# EAGLE design Buck-Boost-Switch-Mode-Power-Supply-Module (EAGLE 9.6.2)
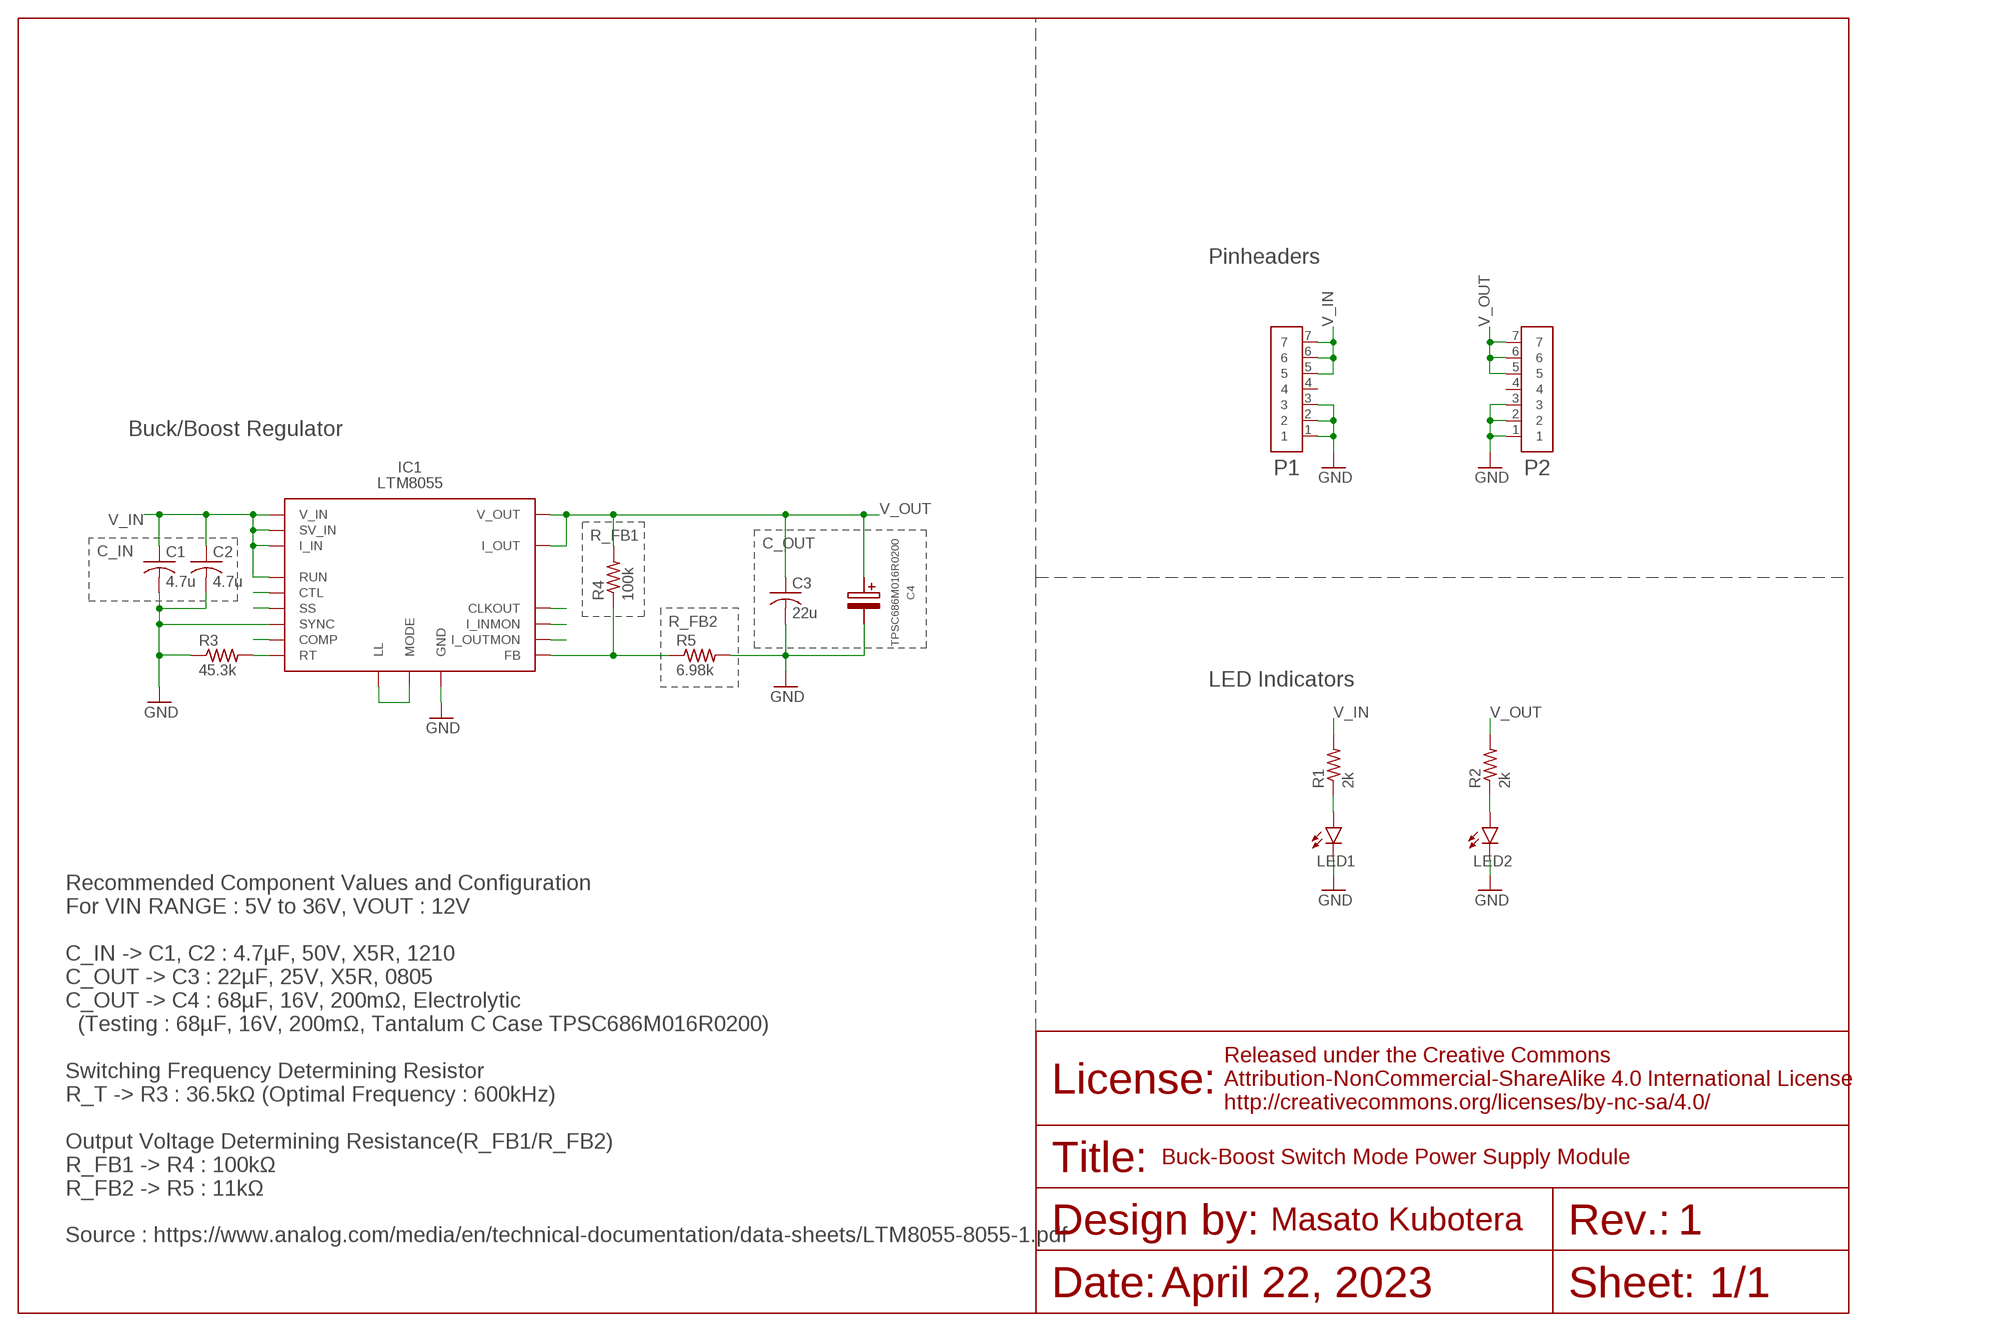
[diagram p0: schematic, sheet 1]

## Parts
C1  4.7u  C-USC0805  [C0805]
C2  4.7u  C-USC0805  [C0805]
C3  22u  C-USC0805  [C0805]
C4  TPSC686M016R0200  [TPSC686M016R0200]
IC1  LTM8055  [LTM8055]
LED1  LEDSML0603  [SML0603]
LED2  LEDSML0603  [SML0603]
P1  PINHEADER-7P  [7P]
P2  PINHEADER-7P  [7P]
R1  2k  R-US_R0603  [R0603]
R2  2k  R-US_R0603  [R0603]
R3  45.3k  R-US_R0603  [R0603]
R4  100k  R-US_R0603  [R0603]
R5  6.98k  R-US_R0603  [R0603]

## Nets
CLKOUT: IC1.G1(CLKOUT)
COMP: IC1.J2(COMP)
FB: IC1.J1(FB) R4.1 R5.1
GND: C1.2 C2.2 C3.2 C4.- IC1.A7(GND) IC1.A8(GND) IC1.A9(GND) IC1.A10(GND) IC1.A11(GND) IC1.B7(GND) IC1.B8(GND) IC1.B9(GND) IC1.B10(GND) IC1.B11(GND) IC1.C7(GND) IC1.C8(GND) IC1.C9(GND) IC1.C10(GND) IC1.C11(GND) IC1.D2(GND) IC1.D3(GND) IC1.D4(GND) IC1.D5(GND) IC1.D6(GND) IC1.D7(GND) IC1.D8(GND) IC1.D9(GND) IC1.D10(GND) IC1.D11(GND) IC1.E1(GND) IC1.E2(GND) IC1.E3(GND) IC1.E4(GND) IC1.E5(GND) IC1.E6(GND) IC1.E7(GND) IC1.E8(GND) IC1.E9(GND) IC1.E10(GND) IC1.E11(GND) IC1.F2(GND) IC1.F3(GND) IC1.F4(GND) IC1.F5(GND) IC1.F6(GND) IC1.F7(GND) IC1.F8(GND) IC1.F9(GND) IC1.G3(GND) IC1.G4(GND) IC1.G5(GND) IC1.G6(GND) IC1.G7(GND) IC1.G8(GND) IC1.G9(GND) IC1.H2(SYNC) IC1.H3(GND) IC1.H4(GND) IC1.H5(GND) IC1.H6(GND) IC1.H7(GND) IC1.H8(GND) IC1.H9(GND) IC1.J3(GND) IC1.J4(GND) IC1.J5(GND) IC1.J6(GND) IC1.J7(GND) IC1.J8(GND) IC1.J9(GND) IC1.K3(GND) IC1.K4(GND) IC1.K5(GND) IC1.K6(GND) IC1.K7(GND) IC1.K8(GND) IC1.K9(GND) IC1.L1(GND) IC1.L5(GND) IC1.L6(GND) IC1.L7(GND) IC1.L8(GND) LED1.C LED2.C P1.1 P1.2 P1.3 P2.1 P2.2 P2.3 R3.1 R5.2
I_INMON: IC1.L3(I_INMON)
I_OUTMON: IC1.L2(I_OUTMON)
LED1: LED1.A R1.1
LED2: LED2.A R2.1
MODE: IC1.F1(LL) IC1.G2(MODE)
RT: IC1.H1(RT) R3.2
SS: IC1.K1(SS)
STL: IC1.K2(CTL)
V_IN: C1.1 C2.1 IC1.F10(SV_IN) IC1.F11(SV_IN) IC1.G10(V_IN) IC1.G11(V_IN) IC1.H10(V_IN) IC1.H11(V_IN) IC1.J10(V_IN) IC1.J11(V_IN) IC1.K10(V_IN) IC1.K11(V_IN) IC1.L4(RUN) IC1.L9(I_IN) IC1.L10(V_IN) IC1.L11(V_IN) P1.5 P1.6 P1.7 R1.2
V_OUT: C3.1 C4.+ IC1.A1(V_OUT) IC1.A2(V_OUT) IC1.A3(V_OUT) IC1.A4(V_OUT) IC1.A5(V_OUT) IC1.A6(V_OUT) IC1.B1(V_OUT) IC1.B2(V_OUT) IC1.B3(V_OUT) IC1.B4(V_OUT) IC1.B5(V_OUT) IC1.B6(V_OUT) IC1.C1(V_OUT) IC1.C2(V_OUT) IC1.C3(V_OUT) IC1.C4(V_OUT) IC1.C5(V_OUT) IC1.C6(V_OUT) IC1.D1(I_OUT) P2.5 P2.6 P2.7 R2.2 R4.2
Unconnected: P1.4 P2.4

## Notes on the sheet
- Pinheaders
- Buck/Boost Regulator
- R_FB1
- C_OUT
- C_IN
- R_FB2
- LED Indicators
- Recommended Component Values and Configuration
  For VIN RANGE : 5V to 36V, VOUT : 12V
  
  C_IN -> C1, C2 : 4.7µF, 50V, X5R, 1210
  C_OUT -> C3 : 22µF, 25V, X5R, 0805
  C_OUT -> C4 : 68µF, 16V, 200mΩ, Electrolytic
    (Testing : 68µF, 16V, 200mΩ, Tantalum C Case TPSC686M016R0200)
  
  Switching Frequency Determining Resistor
  R_T -> R3 : 36.5kΩ (Optimal Frequency : 600kHz)
  
  Output Voltage Determining Resistance(R_FB1/R_FB2) 
  R_FB1 -> R4 : 100kΩ
  R_FB2 -> R5 : 11kΩ
  
  Source : https://www.analog.com/media/en/technical-documentation/data-sheets/LTM8055-8055-1.pdf
- Buck-Boost Switch Mode Power Supply Module
- 1
- April 22, 2023 | 1/1

## Library data of the parts
C1-C3 = rcl:C-US: CAPACITOR, American symbol; SPICEPREFIX: C
C4 = TPSC686M016R0200:TPSC686M016R0200
IC1 = LTM8055:LTM8055
LED1 LED2 = led:LED: LED OSRAM: - CHIPLED LG R971, LG N971, LY N971, LG Q971, LY Q971, LO R971, LY R971 LH N974, LH R974 LS Q976, LO Q976, LY Q976 LO Q996 - Hyper CHIPLED LW Q18S LB Q993, LB Q99A, LB R99A - SideLED LS A670, LO A670, LY A670, LG A670, LP A670 LB A673, LV A673, LT A673, LW A673 LH A674 LY A675 LS A676, LA A676, LO A676, LY A676, LW A676 LS A679, LY A679, LG A679 - Hyper Micro SIDELED® LS Y876, LA Y876, LO Y876, LY Y876 LT Y87S - SmartLED LW L88C, LW L88S LB L89C, LB L89S, LG L890 LS L89K, LO L89K, LY L89K LS L896, LA L896, LO L896, LY L896 - TOPLED LS T670, LO T670, LY T670, LG T670, LP T670 LSG T670, LSP T670, LSY T670, LOP T670, LYG T670 LG T671, LOG T671, LSG T671 LB T673, LV T673, LT T673, LW T673 LH T674 LS T676, LA T676, LO T676, LY T676, LB T676, LH T676, LSB T676, LW T676 LB T67C, LV T67C, LT T67C, LS T67K, LO T67K, LY T67K, LW E67C LS E67B, LA E67B, LO E67B, LY E67B, LB E67C, LV E67C, LT E67C LW T67C LS T679, LY T679, LG T679 LS T770, LO T770, LY T770, LG T770, LP T770 LB T773, LV T773, LT T773, LW T773 LH T774 LS E675, LA E675, LY E675, LS T675 LS T776, LA T776, LO T776, LY T776, LB T776 LHGB T686 LT T68C, LB T68C - Hyper Mini TOPLED® LB M676 - Mini TOPLED Santana® LG M470 LS M47K, LO M47K, LY M47K Source: http://www.osram.convergy.de LUXEON: - LUMILED® LXK2-PW12-R00, LXK2-PW12-S00, LXK2-PW14-U00, LXK2-PW14-V00 LXK2-PM12-R00, LXK2-PM12-S00, LXK2-PM14-U00 LXK2-PE12-Q00, LXK2-PE12-R00, LXK2-PE12-S00, LXK2-PE14-T00, LXK2-PE14-U00 LXK2-PB12-K00, LXK2-PB12-L00, LXK2-PB12-M00, LXK2-PB14-N00, LXK2-PB14-P00, LXK2-PB14-Q00 LXK2-PR12-L00, LXK2-PR12-M00, LXK2-PR14-Q00, LXK2-PR14-R00 LXK2-PD12-Q00, LXK2-PD12-R00, LXK2-PD12-S00 LXK2-PH12-R00, LXK2-PH12-S00 LXK2-PL12-P00, LXK2-PL12-Q00, LXK2-PL12-R00 Source: www.luxeon.com KINGBRIGHT: KA-3528ASYC Source: www.kingbright.com
P1 P2 = Pinheader:PINHEADER-7P
R1-R5 = rcl:R-US_: RESISTOR, American symbol; SPICEPREFIX: R

## Net classes
0 default: width 0.203 mm, drill 0.35 mm, clearance 0.203 mm

## Board
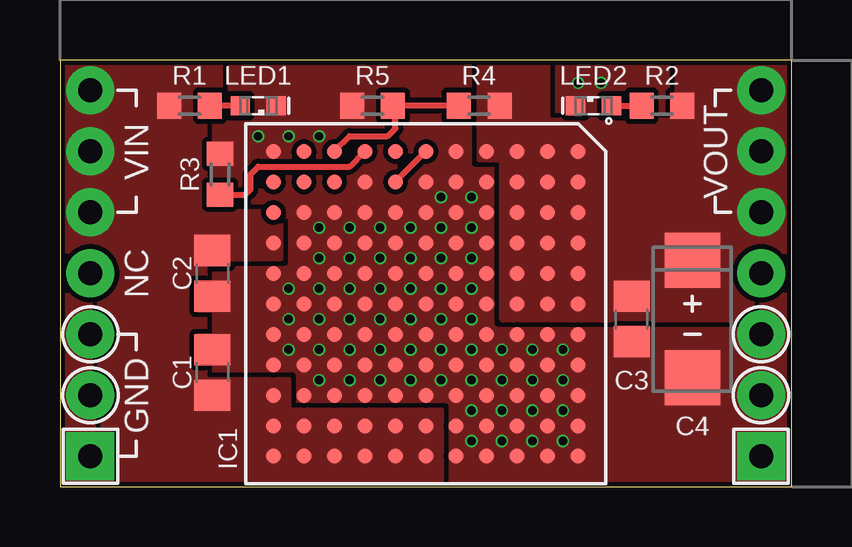
[diagram p1: board, top side]
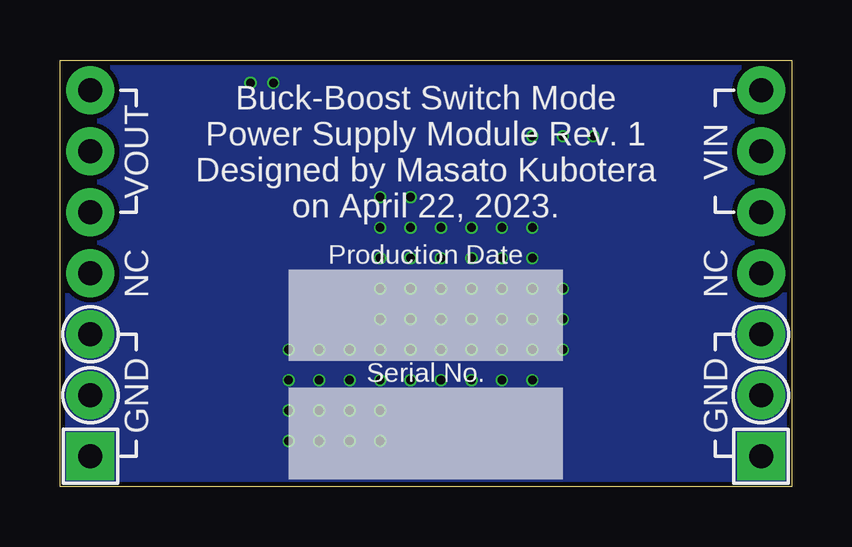
[diagram p2: board, bottom side, seen from below]

Size 30.48 x 17.78 mm. Coordinates in mm from the lower left corner, seen from the top.
Outline: 0,0 30.48,0 30.48,17.78 0,17.78 0,0
Copper layers (1*16): Top 0.035mm / dielectric 1.6mm / Bottom 0.035mm
Design rules "jlcpcb-2layers": minimum track width 5mil, minimum drill 0.3mm, track to track 5mil, track to pad 5mil, pad to pad 5mil, via to via 5mil, smd to smd 5mil, copper to edge 0.2mm, drill to drill 6mil, minimum pad ring 10mil, minimum via ring 3mil, stop-mask expansion 4mil, vias tented up to drill 0mil, thermal gap 10mil

### Footprints (pad centres in the part's own frame; a part is rotated, then mirrored left to right if it is on the bottom)
C0805 = smd 1.3 x 1.5: 1 -0.95,0; 2 0.95,0
TPSC686M016R0200 = smd 2.3 x 2.3: + -2.45,0; - 2.45,0
LTM8055 = smd 0.635 x 0.635: A1 -6.35,6.35; A2 -5.08,6.35; A3 -3.81,6.35; A4 -2.54,6.35; A5 -1.27,6.35; A6 0,6.35; A7 1.27,6.35; A8 2.54,6.35; A9 3.81,6.35; A10 5.08,6.35; A11 6.35,6.35; B1 -6.35,5.08; B2 -5.08,5.08; B3 -3.81,5.08; B4 -2.54,5.08; B5 -1.27,5.08; B6 0,5.08; B7 1.27,5.08; B8 2.54,5.08; B9 3.81,5.08; B10 5.08,5.08; B11 6.35,5.08; C1 -6.35,3.81; C2 -5.08,3.81; C3 -3.81,3.81; C4 -2.54,3.81; C5 -1.27,3.81; C6 0,3.81; C7 1.27,3.81; C8 2.54,3.81; C9 3.81,3.81; C10 5.08,3.81; C11 6.35,3.81; D1 -6.35,2.54; D2 -5.08,2.54; D3 -3.81,2.54; D4 -2.54,2.54; D5 -1.27,2.54; D6 0,2.54; D7 1.27,2.54; D8 2.54,2.54; D9 3.81,2.54; D10 5.08,2.54; D11 6.35,2.54; E1 -6.35,1.27; E2 -5.08,1.27; E3 -3.81,1.27; E4 -2.54,1.27; E5 -1.27,1.27; E6 0,1.27; E7 1.27,1.27; E8 2.54,1.27; E9 3.81,1.27; E10 5.08,1.27; E11 6.35,1.27; F1 -6.35,0; F2 -5.08,0; F3 -3.81,0; F4 -2.54,0; F5 -1.27,0; F6 0,0; F7 1.27,0; F8 2.54,0; F9 3.81,0; F10 5.08,0; F11 6.35,0; G1 -6.35,-1.27; G2 -5.08,-1.27; G3 -3.81,-1.27; G4 -2.54,-1.27; G5 -1.27,-1.27; G6 0,-1.27; G7 1.27,-1.27; G8 2.54,-1.27; G9 3.81,-1.27; G10 5.08,-1.27; G11 6.35,-1.27; H1 -6.35,-2.54; H2 -5.08,-2.54; H3 -3.81,-2.54; H4 -2.54,-2.54; H5 -1.27,-2.54; H6 0,-2.54; H7 1.27,-2.54; H8 2.54,-2.54; H9 3.81,-2.54; H10 5.08,-2.54; H11 6.35,-2.54; J1 -6.35,-3.81; J2 -5.08,-3.81; J3 -3.81,-3.81; J4 -2.54,-3.81; J5 -1.27,-3.81; J6 0,-3.81; J7 1.27,-3.81; J8 2.54,-3.81; J9 3.81,-3.81; J10 5.08,-3.81; J11 6.35,-3.81; K1 -6.35,-5.08; K2 -5.08,-5.08; K3 -3.81,-5.08; K4 -2.54,-5.08; K5 -1.27,-5.08; K6 0,-5.08; K7 1.27,-5.08; K8 2.54,-5.08; K9 3.81,-5.08; K10 5.08,-5.08; K11 6.35,-5.08; L1 -6.35,-6.35; L2 -5.08,-6.35; L3 -3.81,-6.35; L4 -2.54,-6.35; L5 -1.27,-6.35; L6 0,-6.35; L7 1.27,-6.35; L8 2.54,-6.35; L9 3.81,-6.35; L10 5.08,-6.35; L11 6.35,-6.35
SML0603 = smd 0.8 x 0.8: A 0.75,0; C -0.75,0
7P = drill 1 pad 2 square: 1 0,7.62 | drill 1 pad 2: 2 0,5.08; 3 0,2.54; 4 0,0; 5 0,-2.54; 6 0,-5.08; 7 0,-7.62
R0603 = smd 1 x 1.1: 1 -0.85,0; 2 0.85,0

### Placement (x,y rotation side)
C1  6.35,4.76 90 top
C2  6.35,8.89 270 top
C3  23.81,6.99 270 top
C4  26.35,6.99 270 top
IC1  15.24,7.62 270 top
LED1  8.25,15.88 180 top
LED2  22.23,15.88 0 top
P1  1.27,8.89 180 top
P2  29.21,8.89 180 top
R1  5.4,15.88 180 top
R2  25.08,15.88 0 top
R3  6.67,13.02 270 top
R4  17.46,15.88 0 top
R5  13.02,15.88 180 top

### Tracks (layer width: path | path; a pad name or v marks a point on that pad's centre or on a via)
FB
  Top 0.254: R5.1 13.97,15.88 | R4.1 13.97,15.88 | 13.97,15.88 13.97,14.92 13.65,14.61 12.07,14.61 IC1.J1
GND  (via drill 0.35)
  other vias: 17.14,1.91 18.41,1.91 19.69,1.91 20.95,1.91 10.79,4.45 12.07,4.45 13.34,4.45 14.61,4.45 15.88,4.45 9.53,5.72 17.14,5.72 18.41,5.72 19.69,5.72 20.95,5.72 17.14,4.45 18.41,4.45 19.69,4.45 20.95,4.45 17.14,3.18 18.41,3.18 19.69,3.18 20.95,3.18 10.79,5.72 12.07,5.72 13.34,5.72 14.61,5.72 15.88,5.72 17.14,9.53 10.79,9.53 12.07,9.53 13.34,9.53 14.61,9.53 15.88,9.53 9.53,8.26 17.14,8.26 10.79,8.26 12.07,8.26 13.34,8.26 14.61,8.26 15.88,8.26 9.53,6.99 17.14,6.99 10.79,6.99 12.07,6.99 13.34,6.99 14.61,6.99 15.88,6.99 17.14,12.07 15.88,12.07 17.14,10.79 10.79,10.79 12.07,10.79 13.34,10.79 14.61,10.79 15.88,10.79 21.59,16.83 22.54,16.83 10.79,14.61 8.25,14.61 9.53,14.61
  pour Top (rank 3, no thermals): -2.54,20.32 -2.54,-2.54 33.02,-2.54 33.02,20.32
  pour Bottom (no thermals): -3.81,21.59 -3.81,-3.81 34.29,-3.81 34.29,21.59
LED1
  Top 0.254: LED1.A R1.1
LED2
  Top 0.254: LED2.A R2.1
MODE
  Top 0.254: IC1.G2 IC1.F1
RT
  Top 0.254: IC1.H1 12.07,13.34 8.25,13.34 7.94,13.02 7.94,12.38 7.72,12.17 R3.2
V_IN
  pour Top (no thermals): -1.27,19.05 -1.27,-1.27 15.88,-1.27 15.88,3.18 9.53,3.18 9.53,4.45 6.03,4.45 6.03,9.53 9.21,9.53 9.21,11.43 6.03,11.43 6.03,16.51 6.67,16.51 6.67,19.05
V_OUT
  pour Top (rank 2, no thermals): 17.46,19.05 17.46,13.65 18.41,13.65 18.41,6.99 31.75,6.99 31.75,19.05 25.72,19.05 25.72,15.24 20.32,15.24 20.32,19.05

### Text on the board
tPlace: VIN | VOUT | NC | GND
bPlace: VIN | Buck-Boost Switch Mode / Power Supply Module Rev. 1 / Designed by Masato Kubotera / on April 22, 2023. | VOUT | Production Date | NC | NC | Serial No. | GND | GND